# EAGLE design oscillVRL75 (EAGLE 6.3)
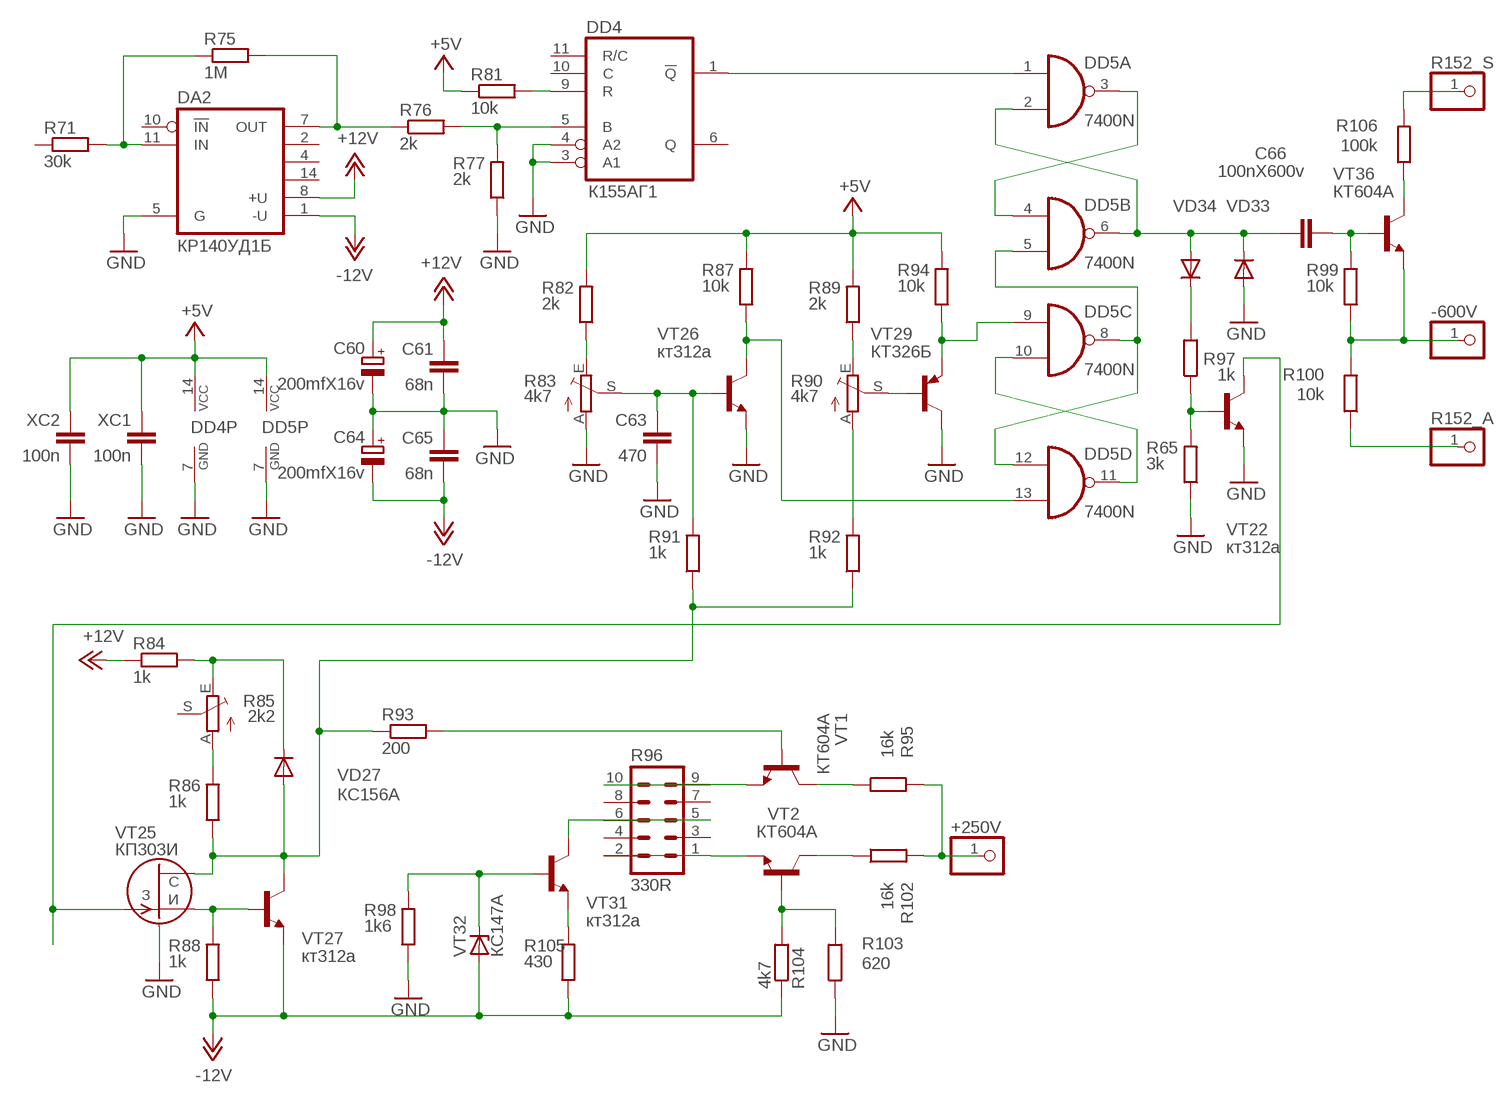
[diagram p0: schematic, sheet 1]

## Parts
+250V  PINHD-1X1  [1X01]
-600V  PINHD-1X1  [1X01]
C60  200mfX16v  CPOL-EUE2.5-6  [E2,5-6]
C61  68n  C-EUC0805  [C0805]
C63  470  C-EU025-025X050  [C025-025X050]
C64  200mfX16v  CPOL-EUE2.5-6  [E2,5-6]
C65  68n  C-EUC0805  [C0805]
C66  100nX600v  C-EU050-025X075  [C050-025X075]
DA2  КР140УД1Б  140UD1(KR)  [DIL14]
DD4  К155АГ1  74121N  [DIL14]
DD5  7400N  [DIL14]
R65  3k  R-EU_M0805  [M0805]
R71  30k  R-EU_M0805  [M0805]
R75  1M  R-EU_M0805  [M0805]
R76  2k  R-EU_M0805  [M0805]
R77  2k  R-EU_M0805  [M0805]
R81  10k  R-EU_M0805  [M0805]
R82  2k  R-EU_M0805  [M0805]
R83  4k7  TRIM_EU-S64Y  [S64Y]
R84  1k  R-EU_M0805  [M0805]
R85  2k2  TRIM_EU-S64Y  [S64Y]
R86  1k  R-EU_M0805  [M0805]
R87  10k  R-EU_M0805  [M0805]
R88  1k  R-EU_M0805  [M0805]
R89  2k  R-EU_M0805  [M0805]
R90  4k7  TRIM_EU-S64Y  [S64Y]
R91  1k  R-EU_M0805  [M0805]
R92  1k  R-EU_M0805  [M0805]
R93  200  R-EU_M0805  [M0805]
R94  10k  R-EU_M0805  [M0805]
R95  16k  R-EU_M1206  [M1206]
R96  330R  MA05-2  [MA05-2]
R97  1k  R-EU_M0805  [M0805]
R98  1k6  R-EU_M0805  [M0805]
R99  10k  R-EU_M1206  [M1206]
R100  10k  R-EU_M1206  [M1206]
R102  16k  R-EU_M1206  [M1206]
R103  620  R-EU_M1206  [M1206]
R104  4k7  R-EU_M1206  [M1206]
R105  430  R-EU_M0805  [M0805]
R106  100k  R-EU_M1206  [M1206]
R152_A  PINHD-1X1  [1X01]
R152_S  PINHD-1X1  [1X01]
VD27  КС156А  DIODE-SOD80C  [SOD80C]
VD33  DIODE-SOD80C  [SOD80C]
VD34  DIODE-SOD80C  [SOD80C]
VT1  КТ604А  -NPN-TO126V  [TO126V]
VT2  КТ604А  -NPN-TO126V  [TO126V]
VT22  кт312а  -NPN-TO92-ECB  [TO92-ECB]
VT25  КП303И  [TO72]
VT26  кт312а  -NPN-TO92-ECB  [TO92-ECB]
VT27  кт312а  -NPN-TO92-ECB  [TO92-ECB]
VT29  КТ326Б  2N3963-PNP-TO18-EBC  [TO18]
VT31  кт312а  -NPN-TO92-ECB  [TO92-ECB]
VT32  КС147А  ZENER-DIODEDO35Z10  [DO35Z10]
VT36  КТ604А  -NPN-TO126V  [TO126V]
XC1  100n  C-EUC0805  [C0805]
XC2  100n  C-EUC0805  [C0805]

## Nets
+5V: DD4.14(VCC) DD5.14(P:VCC) R81.1 R82.2 R87.2 R89.2 R94.2 XC1.1 XC2.1
+12V: C60.+ C61.1 DA2.8(+U) R84.1
-12V: C64.- C65.2 DA2.1(-U) R88.1 R104.1 R105.1 VT27.E VT32.A
GND: C60.- C61.2 C63.2 C64.+ C65.1 DA2.5(G) DD4.3(A1) DD4.4(A2) DD4.7(GND) DD5.7(P:GND) R65.1 R77.1 R83.A R98.1 R103.1 VD33.A VT22.E VT25.4(GND) VT26.E VT29.3(C) XC1.2 XC2.2
N$1: DA2.11(IN) R71.2 R75.1
N$2: DA2.7(OUT) R75.2 R76.1
N$3: R82.1 R83.E
N$4: DD4.9(R) R81.2
N$5: DD4.1(!Q) DD5.1(A:I0)
N$6: DD4.5(B) R76.2 R77.2
N$7: C66.1 DD5.2(A:I1) DD5.6(B:O) VD33.C VD34.A
N$8: C63.1 R83.S R91.2 VT26.B
N$9: DD5.3(A:O) DD5.4(B:I0)
N$10: DD5.10(C:I1) DD5.11(D:O)
N$11: DD5.13(D:I1) R87.1 VT26.C
N$12: R89.1 R90.E
N$13: DD5.5(B:I1) DD5.8(C:O) DD5.12(D:I0)
N$14: R90.A R92.2
N$15: R90.S VT29.2(B)
N$16: R97.2 VD34.C
N$17: DD5.9(C:I0) R94.1 VT29.1(E)
N$18: C66.2 R99.2 VT36.3(B)
N$19: -600V.1 R99.1 R100.2 VT36.1(E)
N$20: R100.1 R152_A.1
N$21: R106.2 R152_S.1
N$22: R106.1 VT36.2(C)
N$23: R65.2 R97.1 VT22.B
N$24: VT22.C VT25.3(G)
N$25: R88.2 VT25.1(S) VT27.B
N$26: R93.2 VT1.3(B)
N$27: R85.A R86.2
N$28: R84.2 R85.E VD27.C
N$29: R86.1 R91.1 R92.1 R93.1 VD27.A VT25.2(D) VT27.C
N$30: R96.9 R96.10 VT1.1(E)
N$31: R96.5 R96.6 VT31.C
N$32: R96.1 R96.2 VT2.1(E)
N$33: R95.1 VT1.2(C)
N$34: R102.1 VT2.2(C)
N$35: +250V.1 R95.2 R102.2
N$36: R103.2 R104.2 VT2.3(B)
N$37: R105.2 VT31.E
N$38: R98.2 VT31.B VT32.C
Unconnected: DA2.2 DA2.4 DA2.10(!IN) DA2.14 DD4.6(Q) DD4.10(C) DD4.11(R/C) R71.1 R85.S R96.3 R96.4 R96.7 R96.8

## Library data of the parts
+250V -600V R152_A R152_S = pinhead:PINHD-1X1: PIN HEADER
C60 C64 = rcl:CPOL-EU: POLARIZED CAPACITOR, European symbol
C61 C63 C65 C66 XC1 XC2 = rcl:C-EU: CAPACITOR, European symbol
DA2 = 140amp:140UD1: 140УД1
DD4 = 74xx-eu:74*121: Monostable MULTIVIBRATOR, schmitt trigger inputs
DD5 = 74xx-eu:74*00: Quad 2-input NAND gate
R65 R71 R75-R77 R81 R82 R84 R86-R89 R91-R95 R97-R100 R102-R106 = rcl:R-EU_: RESISTOR, European symbol
R83 R85 R90 = pot:TRIM_EU-: POTENTIOMETER
R96 = con-lstb:MA05-2: PIN HEADER; OC_FARNELL: unknown; OC_NEWARK: unknown
VD27 VD33 VD34 = diode:DIODE-: DIODE
VT1 VT2 VT22 VT26 VT27 VT31 VT36 = transistor:*-NPN-: NPN Transistror BF959 corrected 2008.03.06
VT25 = Советские транзисторы:КП30: N-канальный транзистор
VT29 = transistor:*-PNP-: PNP Transistror
VT32 = diode:ZENER-DIODE: Z-Diode

## Board
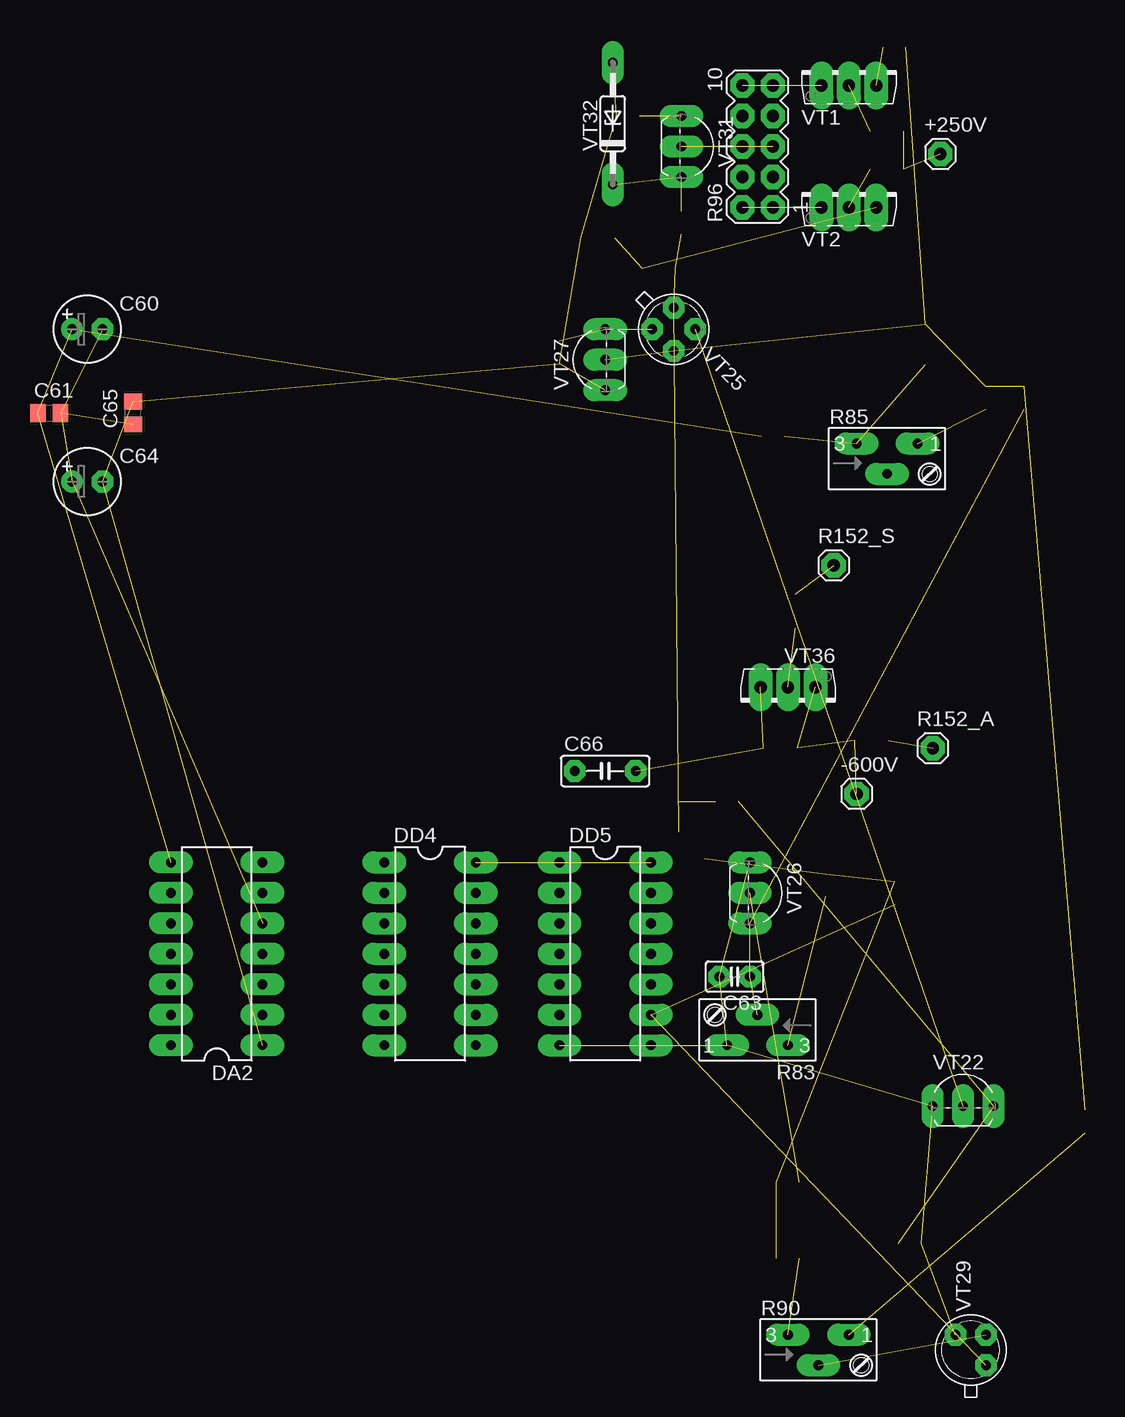
[diagram p1: board, top side]
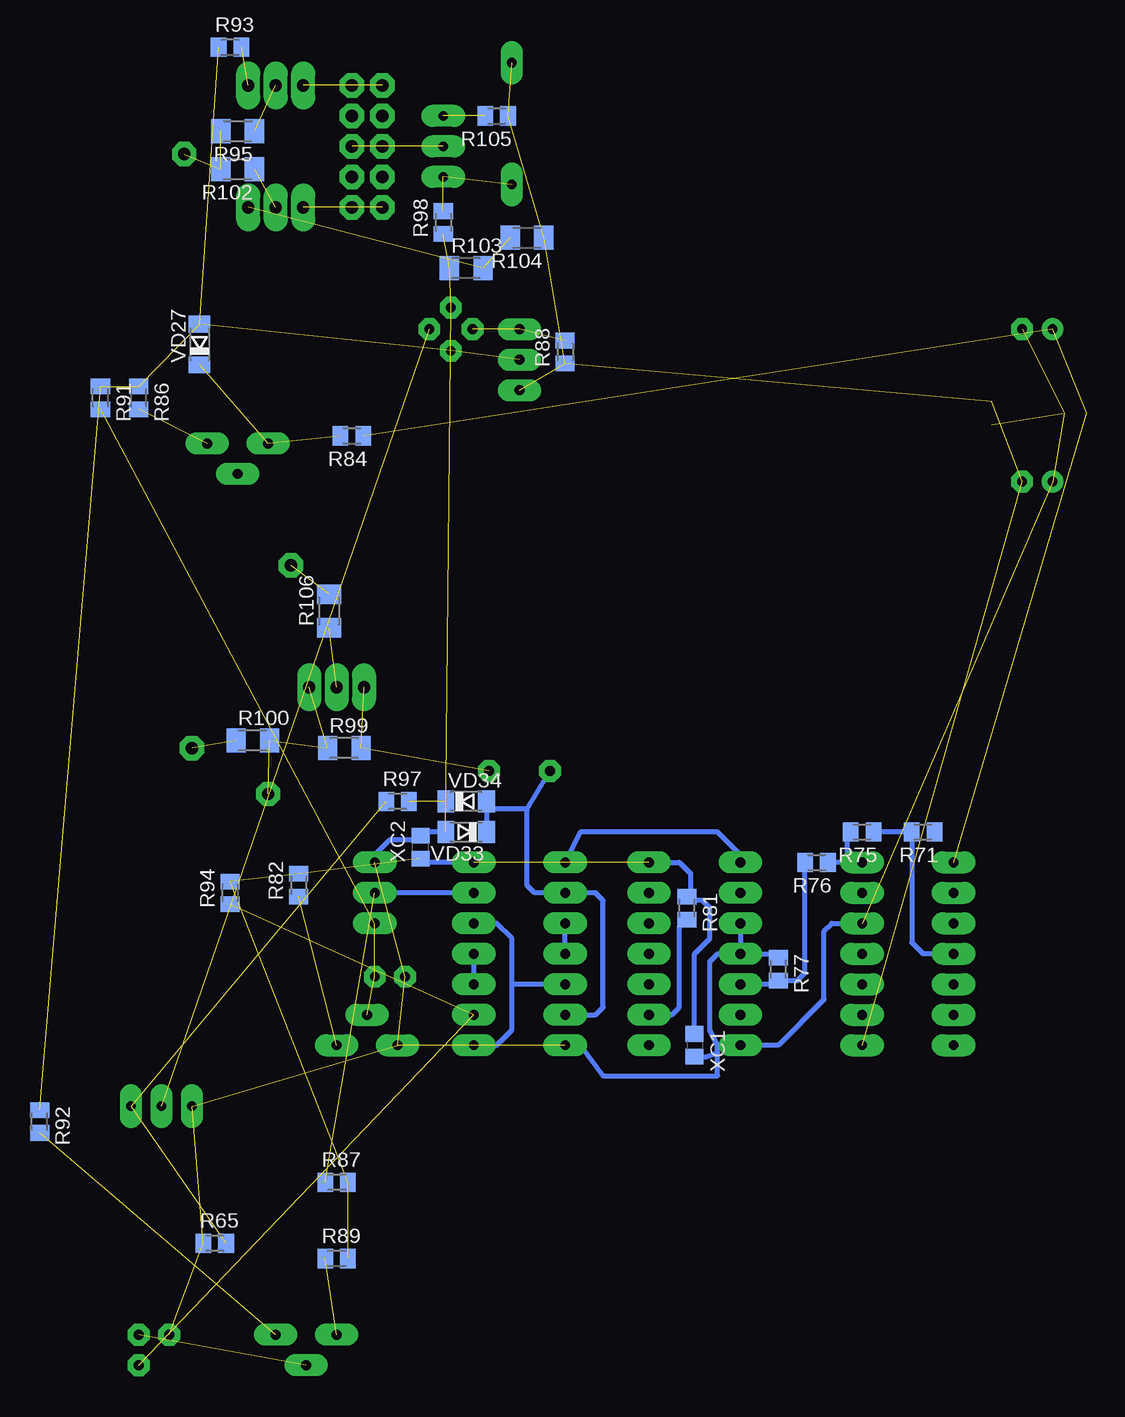
[diagram p2: board, bottom side, seen from below]

No outline drawn. Coordinates in mm, seen from the top.
Copper layers (1*16): Top 0.035mm / dielectric 1.5mm / Bottom 0.035mm
Design rules "DesignRules": minimum track width 8mil, minimum drill 24mil, track to track 0.2mm, track to pad 0.2mm, pad to pad 8mil, via to via 8mil, smd to smd 8mil, copper to edge 10mil, drill to drill 8mil, minimum pad ring 0.5mm, minimum via ring 8mil, stop-mask expansion 4mil, vias tented up to drill 0mil, thermal gap 10mil

### Footprints (pad centres in the part's own frame; a part is rotated, then mirrored left to right if it is on the bottom)
1X01 = drill 1.016 octagon: 1 0,0
E2,5-6 = drill 0.813 pad 1.6: + -1.27,0 | drill 0.813 pad 1.6 octagon: - 1.27,0
C0805 = smd 1.3 x 1.5: 1 -0.95,0; 2 0.95,0
C025-025X050 = drill 0.813 octagon: 1 -1.27,0; 2 1.27,0
C050-025X075 = drill 0.813 octagon: 1 -2.54,0; 2 2.54,0
DIL14 = drill 0.813 long: 1 -7.62,-3.81; 2 -5.08,-3.81; 3 -2.54,-3.81; 4 0,-3.81; 5 2.54,-3.81; 6 5.08,-3.81; 7 7.62,-3.81; 8 7.62,3.81; 9 5.08,3.81; 10 2.54,3.81; 11 0,3.81; 12 -2.54,3.81; 13 -5.08,3.81; 14 -7.62,3.81
M0805 = smd 1.3 x 1.6: 1 -0.95,0; 2 0.95,0
S64Y = drill 0.813 long: A 2.54,1.27; E -2.54,1.27; S 0,-1.27
M1206 = smd 1.6 x 2: 1 -1.4,0; 2 1.4,0
MA05-2 = drill 1.016 octagon: 1 -5.08,-1.27; 2 -5.08,1.27; 3 -2.54,-1.27; 4 -2.54,1.27; 5 0,-1.27; 6 0,1.27; 7 2.54,-1.27; 8 2.54,1.27; 9 5.08,-1.27; 10 5.08,1.27
SOD80C = smd 1.4 x 1.8: A 1.7,0; C -1.7,0
TO126V = drill 1.016 long: 1 -2.286,-1.27; 2 0,-1.27; 3 2.286,-1.27
TO92-ECB = drill 0.813 long: B 2.54,0; C 0,0; E -2.54,0
TO72 = drill 0.813 octagon: 1 -1.27,-1.27; 2 1.27,-1.27; 3 1.27,1.27; 4 -1.27,1.27
TO18 = drill 0.813 octagon: 1 -1.27,-1.27; 2 1.27,-1.27; 3 1.27,1.27
DO35Z10 = drill 0.813 long: A 5.08,0; C -5.08,0

### Placement (x,y rotation side)
+250V  85.72,85.72 0 top
-600V  78.74,32.38 0 top
C60  14.61,71.12 0 top
C61  11.43,64.14 0 top
C63  68.58,17.14 180 top
C64  14.61,58.42 0 top
C65  18.41,64.14 90 top
C66  57.78,34.29 0 top
DA2  25.4,19.05 90 top
DD4  43.18,19.05 270 top
DD5  57.78,19.05 270 top
R65  83.19,-5.08 0 bottom
R71  24.13,29.21 180 bottom
R75  29.21,29.21 180 bottom
R76  33.02,26.67 180 bottom
R77  36.2,17.78 270 bottom
R81  43.81,22.86 270 bottom
R82  76.2,24.77 90 bottom
R83  70.48,12.7 180 top
R84  71.75,62.23 180 bottom
R85  81.28,60.33 0 top
R86  89.53,65.41 270 bottom
R87  73.03,0 0 bottom
R88  53.98,69.22 90 bottom
R89  73.03,-6.35 0 bottom
R90  75.56,-13.97 0 top
R91  92.71,65.41 270 bottom
R92  97.79,5.08 270 bottom
R93  81.92,94.61 0 bottom
R94  81.92,24.13 90 bottom
R95  81.28,87.63 180 bottom
R96  70.48,86.36 90 top
R97  67.94,31.75 0 bottom
R98  64.14,80.01 90 bottom
R99  72.39,36.2 0 bottom
R100  80.01,36.83 0 bottom
R102  81.28,84.45 180 bottom
R103  62.23,76.2 0 bottom
R104  57.15,78.74 180 bottom
R105  59.69,88.9 180 bottom
R106  73.66,47.62 90 bottom
R152_A  85.09,36.2 0 top
R152_S  76.83,51.44 0 top
VD27  84.45,69.85 90 bottom
VD33  62.23,29.21 180 bottom
VD34  62.23,31.75 0 bottom
VT1  78.11,92.71 0 top
VT2  78.11,82.55 0 top
VT22  87.63,6.35 0 top
VT25  63.5,71.12 315 top
VT26  69.85,24.13 270 top
VT27  57.78,68.58 90 top
VT29  88.27,-13.97 90 top
VT31  64.14,86.36 270 top
VT32  58.42,88.27 90 top
VT36  73.03,40.01 180 top
XC1  43.18,11.43 270 bottom
XC2  66.04,27.94 90 bottom

### Tracks (layer width: path | path; a pad name or v marks a point on that pad's centre or on a via)
+5V  (5 unrouted)
  Bottom 0.406: DD4.14 44.45,26.67 43.5,25.72 43.5,24.13 R81.1 43.5,23.5 42.55,23.5 41.91,22.86 41.91,20.32 43.18,19.05 XC1.1 | DD5.14 65.72,26.67 XC2.1
+12V  (3 unrouted)
-12V  (7 unrouted)
GND  (13 unrouted)
  Bottom 0.406: DA2.5 31.75,21.59 32.38,20.95 32.38,15.24 36.2,11.43 DD4.7 41.27,11.43 | DD4.4 36.52,19.05 R77.1 | DD4.3 DD4.4 | 41.27,11.43 41.91,12.7 41.91,18.41 41.27,19.05 DD4.4 | DD5.7 52.7,11.43 50.8,8.89 41.27,8.89 41.27,10.79 | 41.27,10.79 41.27,11.43 | XC1.2 42.23,10.48 41.27,10.79 | VD33.A 65.72,29.21 XC2.2 66.36,28.57 68.58,28.57 69.85,27.3 VT26.E
N$1
  Bottom 0.406: R75.1 R71.2 25.08,20 24.13,19.05 DA2.11
N$2
  Bottom 0.406: DA2.7 30.48,26.67 | 30.48,26.67 R76.1 | R75.2 30.48,29.21 30.48,26.67
N$3  (1 unrouted)
N$4
  Bottom 0.406: DD4.9 45.09,13.97 44.45,14.61 44.45,21.27 R81.2
N$5
  Bottom 0.406: DD4.1 39.37,27.3 41.27,29.21 52.7,29.21 DD5.1
N$6
  Bottom 0.406: DD4.5 36.52,16.51 R77.2 34.6,16.83 33.97,17.46 R76.2
N$7
  Bottom 0.406: DD5.6 51.44,13.97 50.8,14.61 50.8,23.5 51.44,24.13 DD5.2 56.52,24.13 57.15,24.77 57.15,31.11 | 57.15,31.11 C66.1 | VD34.A 60.53,31.11 | 60.53,31.11 VD33.C | 57.15,31.11 60.53,31.11
N$8  (3 unrouted)
N$9
  Bottom 0.406: DD5.4 DD5.3
N$10
  Bottom 0.406: DD5.11 DD5.10
N$11  (1 unrouted)
  Bottom 0.406: DD5.13 VT26.C
N$12  (1 unrouted)
N$13
  Bottom 0.406: DD5.8 59.69,11.43 58.42,12.7 58.42,16.51 | 58.42,16.51 58.42,20.32 59.69,21.59 DD5.12 | DD5.5 58.42,16.51
N$14  (1 unrouted)
N$15  (1 unrouted)
N$16  (1 unrouted)
N$17  (2 unrouted)
N$18  (2 unrouted)
N$19  (3 unrouted)
N$20  (1 unrouted)
N$21  (1 unrouted)
N$22  (1 unrouted)
N$23  (2 unrouted)
N$24  (1 unrouted)
N$25  (2 unrouted)
N$26  (1 unrouted)
N$27  (1 unrouted)
N$28  (2 unrouted)
N$29  (6 unrouted)
N$30  (2 unrouted)
N$31  (2 unrouted)
N$32  (2 unrouted)
N$33  (1 unrouted)
N$34  (1 unrouted)
N$35  (2 unrouted)
N$36  (2 unrouted)
N$37  (1 unrouted)
N$38  (2 unrouted)